# EAGLE design cubesatsim-main-1.0 (EAGLE 7.5.0)
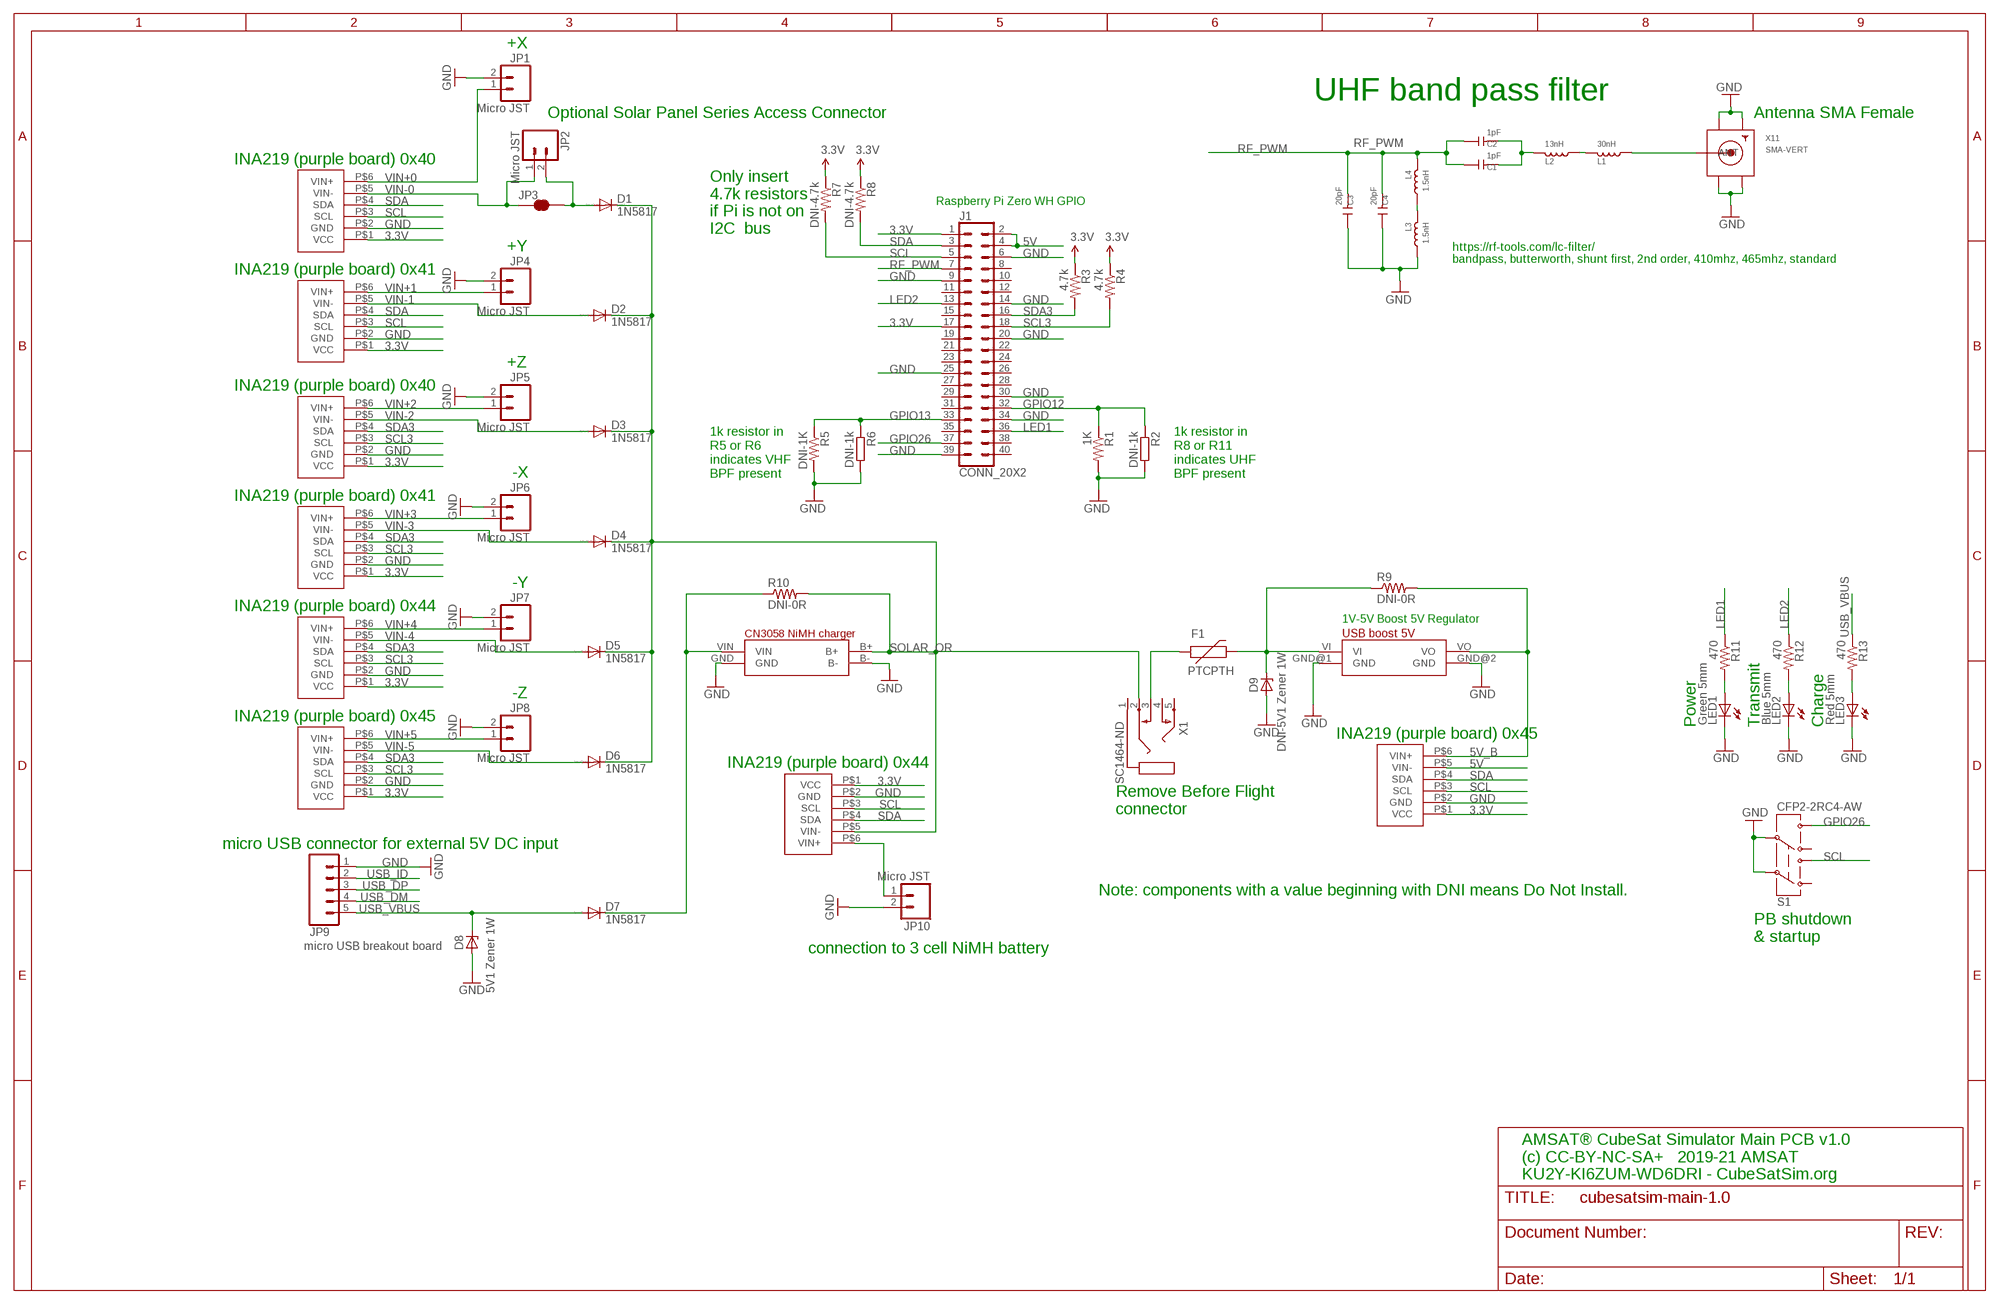
[diagram p0: schematic, sheet 1]

## Parts
C1  1pF  CERAMIC-10PF-50V-5%-NPO(0603)  [C0603]
C2  1pF  CERAMIC-10PF-50V-5%-NPO(0603)  [C0603]
C3  20pF  CERAMIC-10PF-50V-5%-NPO(0603)  [C0603]
C4  20pF  CERAMIC-10PF-50V-5%-NPO(0603)  [C0603]
D1  1N5817  DIODE-D-2.5  [D-2.5]
D2  1N5817  DIODE-D-2.5  [D-2.5]
D3  1N5817  DIODE-D-2.5  [D-2.5]
D4  1N5817  DIODE-D-2.5  [D-2.5]
D5  1N5817  DIODE-D-2.5  [D-2.5]
D6  1N5817  DIODE-D-2.5  [D-2.5]
D7  1N5817  DIODE-D-2.5  [D-2.5]
D8  5V1 Zener 1W  ZENER-DIODEZD-2.5  [ZDIO-2.5]
D9  DNI-5V1 Zener 1W  ZENER-DIODEZD-2.5  [ZDIO-2.5]
F1  PTCPTH  [PTC]
J1  CONN_20X2  [2X20]
JP1  Micro JST  M02JST-PTH-VERT  [JST-2-PTH-VERT]
JP2  Micro JST  M02JST-PTH-VERT  [JST-2-PTH-VERT]
JP3  VDD-EN  JUMPER-SMT_2_NC_TRACE_SILK  [SMT-JUMPER_2_NC_TRACE_SILK]
JP4  Micro JST  M02JST-PTH-VERT  [JST-2-PTH-VERT]
JP5  Micro JST  M02JST-PTH-VERT  [JST-2-PTH-VERT]
JP6  Micro JST  M02JST-PTH-VERT  [JST-2-PTH-VERT]
JP7  Micro JST  M02JST-PTH-VERT  [JST-2-PTH-VERT]
JP8  Micro JST  M02JST-PTH-VERT  [JST-2-PTH-VERT]
JP9  micro USB breakout board  M05NO_SILK  [1X05_NO_SILK]
JP10  Micro JST  M02JST-PTH-VERT  [JST-2-PTH-VERT]
L1  30nH  SMD-FERRITE-CHIP-120-OHM-500MA(0603)  [L0603]
L2  13nH  SMD-FERRITE-CHIP-120-OHM-500MA(0603)  [L0603]
L3  1.5nH  SMD-FERRITE-CHIP-120-OHM-500MA(0603)  [L0603]
L4  1.5nH  SMD-FERRITE-CHIP-120-OHM-500MA(0603)  [L0603]
LED1  Green 5mm  LED3MM  [LED3MM]
LED2  Blue 5mm  LED3MM  [LED3MM]
LED3  Red 5mm  LED3MM  [LED3MM]
R1  1K  RESISTORPTH-1/4W-VERT-KIT  [AXIAL-0.1EZ]
R2  DNI-1k  R-EU_R0603  [R0603]
R3  4.7k  RESISTORPTH-1/4W-VERT-KIT  [AXIAL-0.1EZ]
R4  4.7k  RESISTORPTH-1/4W-VERT-KIT  [AXIAL-0.1EZ]
R5  DNI-1K  RESISTORPTH-1/4W-VERT-KIT  [AXIAL-0.1EZ]
R6  DNI-1k  R-EU_R0603  [R0603]
R7  DNI-4.7k  RESISTORPTH-1/4W-VERT-KIT  [AXIAL-0.1EZ]
R8  DNI-4.7k  RESISTORPTH-1/4W-VERT-KIT  [AXIAL-0.1EZ]
R9  DNI-0R  RESISTORPTH-1/4W-VERT-KIT  [AXIAL-0.1EZ]
R10  DNI-0R  RESISTORPTH-1/4W-VERT-KIT  [AXIAL-0.1EZ]
R11  470  RESISTORPTH-1/4W-VERT-KIT  [AXIAL-0.1EZ]
R12  470  RESISTORPTH-1/4W-VERT-KIT  [AXIAL-0.1EZ]
R13  470  RESISTORPTH-1/4W-VERT-KIT  [AXIAL-0.1EZ]
S1  CFP2-2RC4-AW  SWITCH-DPDTOS  [OS]
U1  INA219 purple board  INA219  [INA219]
U2  INA219 purple board  INA219  [INA219]
U3  INA219 purple board  INA219  [INA219]
U4  INA219 purple board  INA219  [INA219]
U5  INA219 purple board  INA219  [INA219]
U6  CN3085-MODULE  [CN3085-MODULE]
U7  1V-5V Boost 5V Regulator  USB-BOOST  [USB-BOOST]
U8  INA219 purple board  INA219  [INA219]
U9  INA219 purple board  INA219  [INA219]
U10  INA219 purple board  INA219  [INA219]
X1  SC1464-ND  PG203J  [PG203J]
X11  SMA-VERT  [SMA-VERT]

## Nets
3.3V: J1.1 J1.17 R3.P$1 R4.P$1 R7.P$1 R8.P$1 U1.P$1(VCC) U2.P$1(VCC) U3.P$1(VCC) U4.P$1(VCC) U5.P$1(VCC) U8.P$1(VCC) U9.P$1(VCC) U10.P$1(VCC)
5V: J1.2 J1.4 U9.P$5(VIN-)
5V_B: R9.P$2 U7.VO U9.P$6(VIN+)
GND: C3.1 C4.1 D8.A D9.A J1.6 J1.9 J1.14 J1.20 J1.25 J1.30 J1.34 J1.39 JP1.2 JP4.2 JP5.2 JP6.2 JP7.2 JP8.2 JP9.1 JP10.2 L3.2 LED1.K(C) LED2.K(C) LED3.K(C) R1.P$2 R2.2 R5.P$2 R6.2 S1.2 S1.5 U1.P$2(GND) U2.P$2(GND) U3.P$2(GND) U4.P$2(GND) U5.P$2(GND) U6.B- U6.GND U7.GND@1(GND) U7.GND@2(GND) U8.P$2(GND) U9.P$2(GND) U10.P$2(GND) X11.GND1 X11.GND2 X11.GND3 X11.GND4
GPIO12: J1.32 R1.P$1 R2.1
GPIO13: J1.33 R5.P$1 R6.1
GPIO26: J1.37 S1.6
LED1: J1.36 R11.P$1
LED2: J1.13 R12.P$1
N$3: D1.A JP2.2 JP3.2
N$4: D9.C F1.P$2 R9.P$1 U7.VI
N$5: JP10.1 U10.P$6(VIN+)
N$6: LED1.A R11.P$2
N$7: F1.P$1 X1.3
N$8: L1.2 X11.ANTENNA(ANT)
N$9: LED2.A R12.P$2
N$10: C1.2 C2.2 L2.1
N$11: LED3.A R13.P$2
N$13: D7.C R10.P$1 U6.VIN
N$28: L3.1 L4.2
N$50: L1.1 L2.2
RF_PWM: C1.1 C2.1 C3.2 C4.2 J1.7 L4.1
SCL: J1.5 R7.P$2 S1.3 U1.P$3(SCL) U2.P$3(SCL) U9.P$3(SCL) U10.P$3(SCL)
SCL3: J1.18 R4.P$2 U3.P$3(SCL) U4.P$3(SCL) U5.P$3(SCL) U8.P$3(SCL)
SDA: J1.3 R8.P$2 U1.P$4(SDA) U2.P$4(SDA) U9.P$4(SDA) U10.P$4(SDA)
SDA3: J1.16 R3.P$2 U3.P$4(SDA) U4.P$4(SDA) U5.P$4(SDA) U8.P$4(SDA)
SOLAR_OR: D1.C D2.C D3.C D4.C D5.C D6.C R10.P$2 U6.B+ U10.P$5(VIN-) X1.2
USB_DM: JP9.4
USB_DP: JP9.3
USB_ID: JP9.2
USB_VBUS: D7.A D8.C JP9.5 R13.P$1
VIN+0: JP1.1 U1.P$6(VIN+)
VIN+1: JP4.1 U2.P$6(VIN+)
VIN+2: JP5.1 U3.P$6(VIN+)
VIN+3: JP6.1 U4.P$6(VIN+)
VIN+4: JP7.1 U5.P$6(VIN+)
VIN+5: JP8.1 U8.P$6(VIN+)
VIN-0: JP2.1 JP3.1 U1.P$5(VIN-)
VIN-1: D2.A U2.P$5(VIN-)
VIN-2: D3.A U3.P$5(VIN-)
VIN-3: D4.A U4.P$5(VIN-)
VIN-4: D5.A U5.P$5(VIN-)
VIN-5: D6.A U8.P$5(VIN-)
Unconnected: J1.8 J1.10 J1.11 J1.12 J1.15 J1.19 J1.21 J1.22 J1.23 J1.24 J1.26 J1.27 J1.28 J1.29 J1.31 J1.35 J1.38 J1.40 S1.1 S1.4 X1.1 X1.4 X1.5

## Notes on the sheet
- +X
- UHF band pass filter
- Optional Solar Panel Series Access Connector | Antenna SMA Female
- INA219 (purple board) 0x40
- Raspberry Pi Zero WH GPIO
- Only insert 
  4.7k resistors
  if Pi is not on
  I2C  bus
- +Y
- https://rf-tools.com/lc-filter/
  bandpass, butterworth, shunt first, 2nd order, 410mhz, 465mhz, standard
- INA219 (purple board) 0x41
- +Z
- INA219 (purple board) 0x40
- -X
- 1k resistor in 
  R5 or R6
  indicates VHF 
  BPF present
- 1k resistor in 
  R8 or R11
  indicates UHF 
  BPF present
- INA219 (purple board) 0x41
- -Y
- INA219 (purple board) 0x44
- 1V-5V Boost 5V Regulator
- -Z
- INA219 (purple board) 0x45
- Power | Transmit | Charge
- INA219 (purple board) 0x45
- INA219 (purple board) 0x44
- Remove Before Flight
  connector
- micro USB connector for external 5V DC input
- Note: components with a value beginning with DNI means Do Not Install.
- PB shutdown
  & startup
- connection to 3 cell NiMH battery
- AMSAT® CubeSat Simulator Main PCB v1.0
  (c) CC-BY-NC-SA+   2019-21 AMSAT
  KU2Y-KI6ZUM-WD6DRI - CubeSatSim.org

## Library data of the parts
C1-C4 = Seeed-OPL-Capacitor:CERAMIC-10PF-50V-5%-NPO(0603): 302010097; VALUE: 10pf
D1-D7 = diode:DIODE-: DIODE
D8 D9 = diode:ZENER-DIODE: Z-Diode
F1 = SparkFun-PowerIC:PTC: Resettable Fuse PTC Resettable Fuse. Spark Fun Electronics SKU : COM-08357
J1 = SparkFun-Connectors-AJ2:CONN_20X2: Multi connection point. Often used as Generic Header-pin footprint for 0.1 inch spaced/style header connections On any of the 0.1 inch spaced packages, you can populate with these: Break Away Headers - Straight <https://www.sparkfun.com/products/116> (PRT-00116) Break Away Male Headers - Right Angle <https://www.sparkfun.com/products/553> (PRT-00553) Female Headers <https://www.sparkfun.com/products/115> (PRT-00115) Break Away Headers - Machine Pin <https://www.sparkfun.com/products/117> (PRT-00117) Break Away Female Headers - Swiss Machine Pin <https://www.sparkfun.com/products/743> (PRT-00743)
JP1 JP2 JP4-JP8 JP10 = SparkFun-Connectors:M02: Standard 2-pin 0.1" header. Use with - straight break away headers ( PRT-00116) - right angle break away headers (PRT-00553) - swiss pins (PRT-00743) - machine pins (PRT-00117) - female headers (PRT-00115) Molex polarized connector foot print use with: PRT-08233 with associated crimp pins and housings. 2.54_SCREWTERM for use with PRT-10571. 3.5mm Screw Terminal footprints for PRT-08084 5mm Screw Terminal footprints for use with PRT-08432
JP3 = SparkFun-Jumpers:JUMPER-SMT_2_NC_TRACE: Normally closed trace jumper This jumper has a trace between two pads so it's normally closed (NC). Use a razor knife to open the connection. For best results follow the IPC guidelines for cutting traces: Cutout at least 0.063 mm (0.005 in). Remove all loose material to clean up the cut area. Seal the cut with an approved epoxy. Reapply solder to reclose the connection.
JP9 = SparkFun-Connectors:M05: Header 5 Standard 5-pin 0.1" header. Use with straight break away headers (SKU : PRT-00116), right angle break away headers (PRT-00553), swiss pins (PRT-00743), machine pins (PRT-00117), and female headers (PRT-00115). Molex polarized connector foot print use with SKU : PRT-08230 with associated crimp pins and housings.
L1-L4 = Seeed-OPL-Inductor:SMD-FERRITE-CHIP-120-OHM-500MA(0603): 303030001; MPN: BLM18AG121SN1D; VALUE: 120
LED1-LED3 = adafruit:LED: LED OSRAM: - CHIPLED LG R971, LG N971, LY N971, LG Q971, LY Q971, LO R971, LY R971 LH N974, LH R974 LS Q976, LO Q976, LY Q976 LO Q996 - Hyper CHIPLED LW Q18S LB Q993, LB Q99A, LB R99A - SideLED LS A670, LO A670, LY A670, LG A670, LP A670 LB A673, LV A673, LT A673, LW A673 LH A674 LY A675 LS A676, LA A676, LO A676, LY A676, LW A676 LS A679, LY A679, LG A679 - Hyper Micro SIDELED® LS Y876, LA Y876, LO Y876, LY Y876 LT Y87S - SmartLED LW L88C, LW L88S LB L89C, LB L89S, LG L890 LS L89K, LO L89K, LY L89K LS L896, LA L896, LO L896, LY L896 - TOPLED LS T670, LO T670, LY T670, LG T670, LP T670 LSG T670, LSP T670, LSY T670, LOP T670, LYG T670 LG T671, LOG T671, LSG T671 LB T673, LV T673, LT T673, LW T673 LH T674 LS T676, LA T676, LO T676, LY T676, LB T676, LH T676, LSB T676, LW T676 LB T67C, LV T67C, LT T67C, LS T67K, LO T67K, LY T67K, LW E67C LS E67B, LA E67B, LO E67B, LY E67B, LB E67C, LV E67C, LT E67C LW T67C LS T679, LY T679, LG T679 LS T770, LO T770, LY T770, LG T770, LP T770 LB T773, LV T773, LT T773, LW T773 LH T774 LS E675, LA E675, LY E675, LS T675 LS T776, LA T776, LO T776, LY T776, LB T776 LHGB T686 LT T68C, LB T68C - Hyper Mini TOPLED® LB M676 - Mini TOPLED Santana® LG M470 LS M47K, LO M47K, LY M47K Source: http://www.osram.convergy.de/
R1 R3-R5 R7-R13 = SparkFun-Resistors:RESISTOR: Resistor Basic schematic elements and footprints for 0603, 1206, and PTH resistors.
R2 R6 = resistor:R-EU_: RESISTOR, European symbol
S1 = SparkFun-Retired-AJ:SWITCH-DPDT: DPDT Version of the COM-00597
U1-U5 U8-U10 = cubsat-sim:INA219
U6 = cubsat-sim:CN3085-MODULE
U7 = cubsat-sim:USB-BOOST
X1 = con-hirschmann:PG203J: MIC/HEADPHONE JACK KS-S stereo microphone/headphone jack PG203JN (Schukat)
X11 = zum_radio:SMA-VERT

## Net classes
1 RF: clearance 0.381 mm

## Board
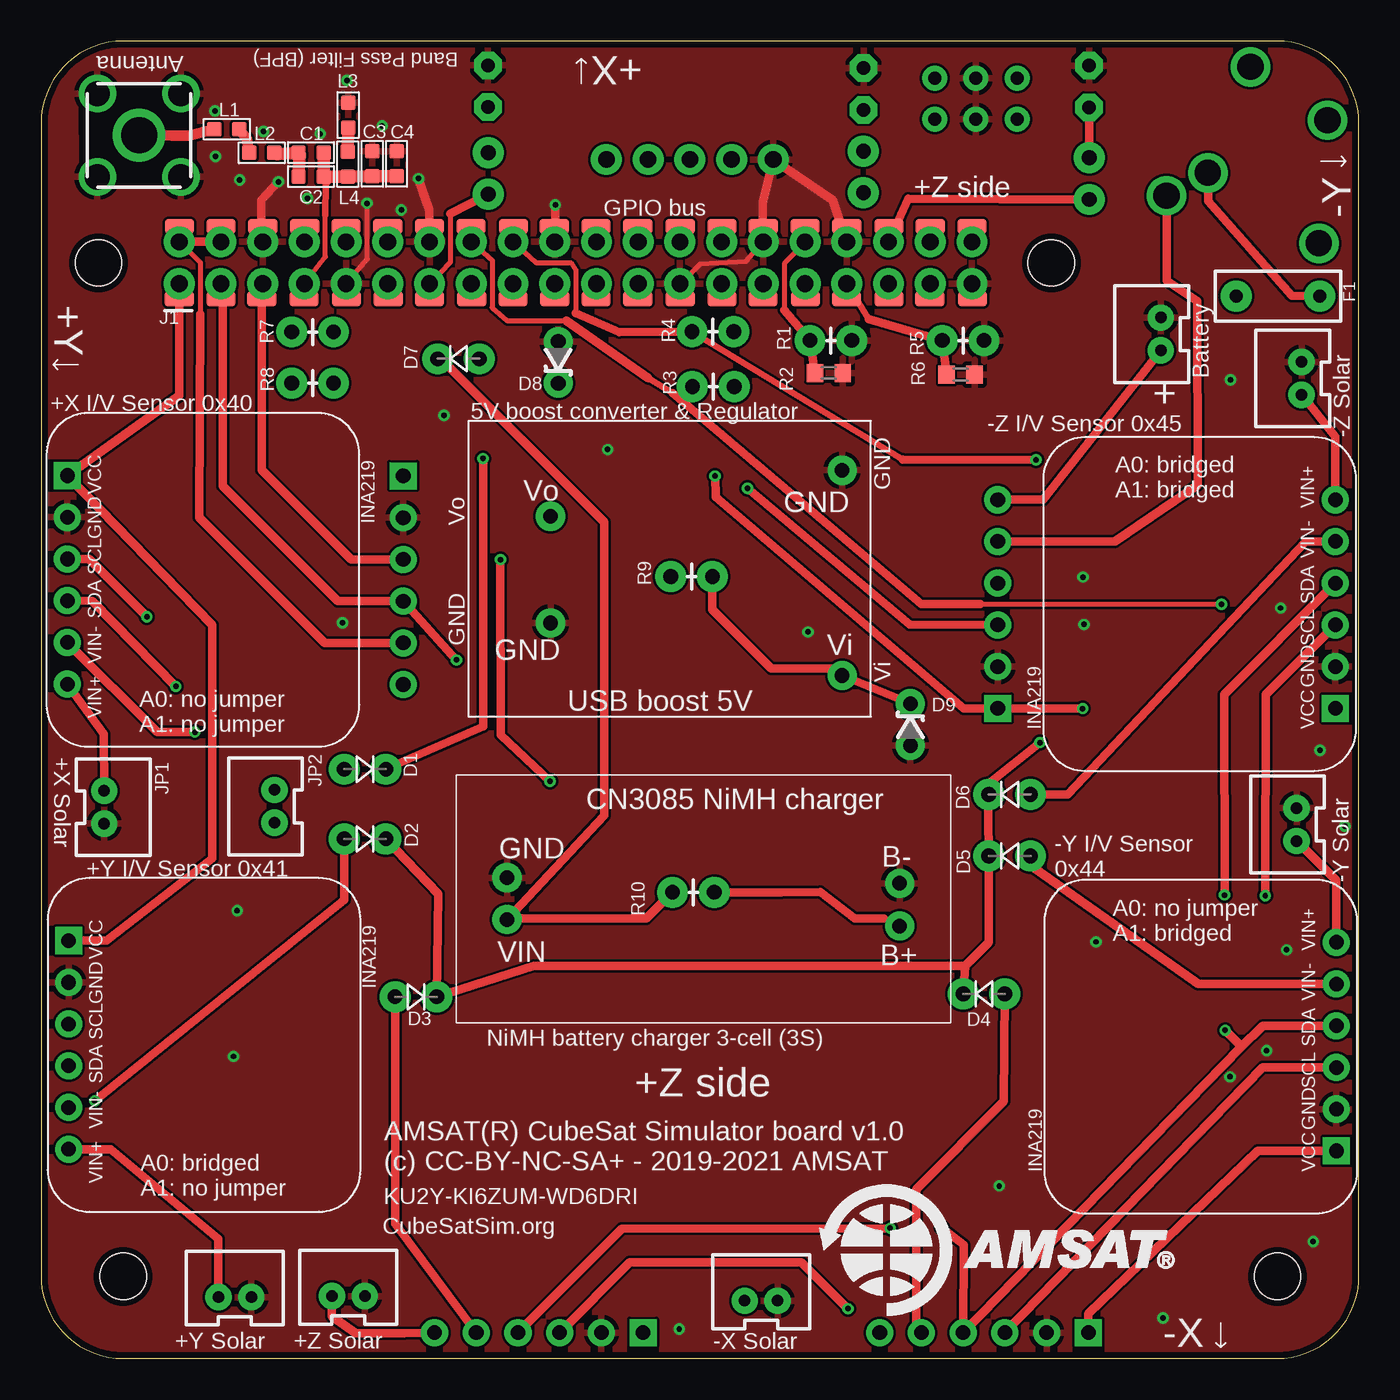
[diagram p1: board, top side]
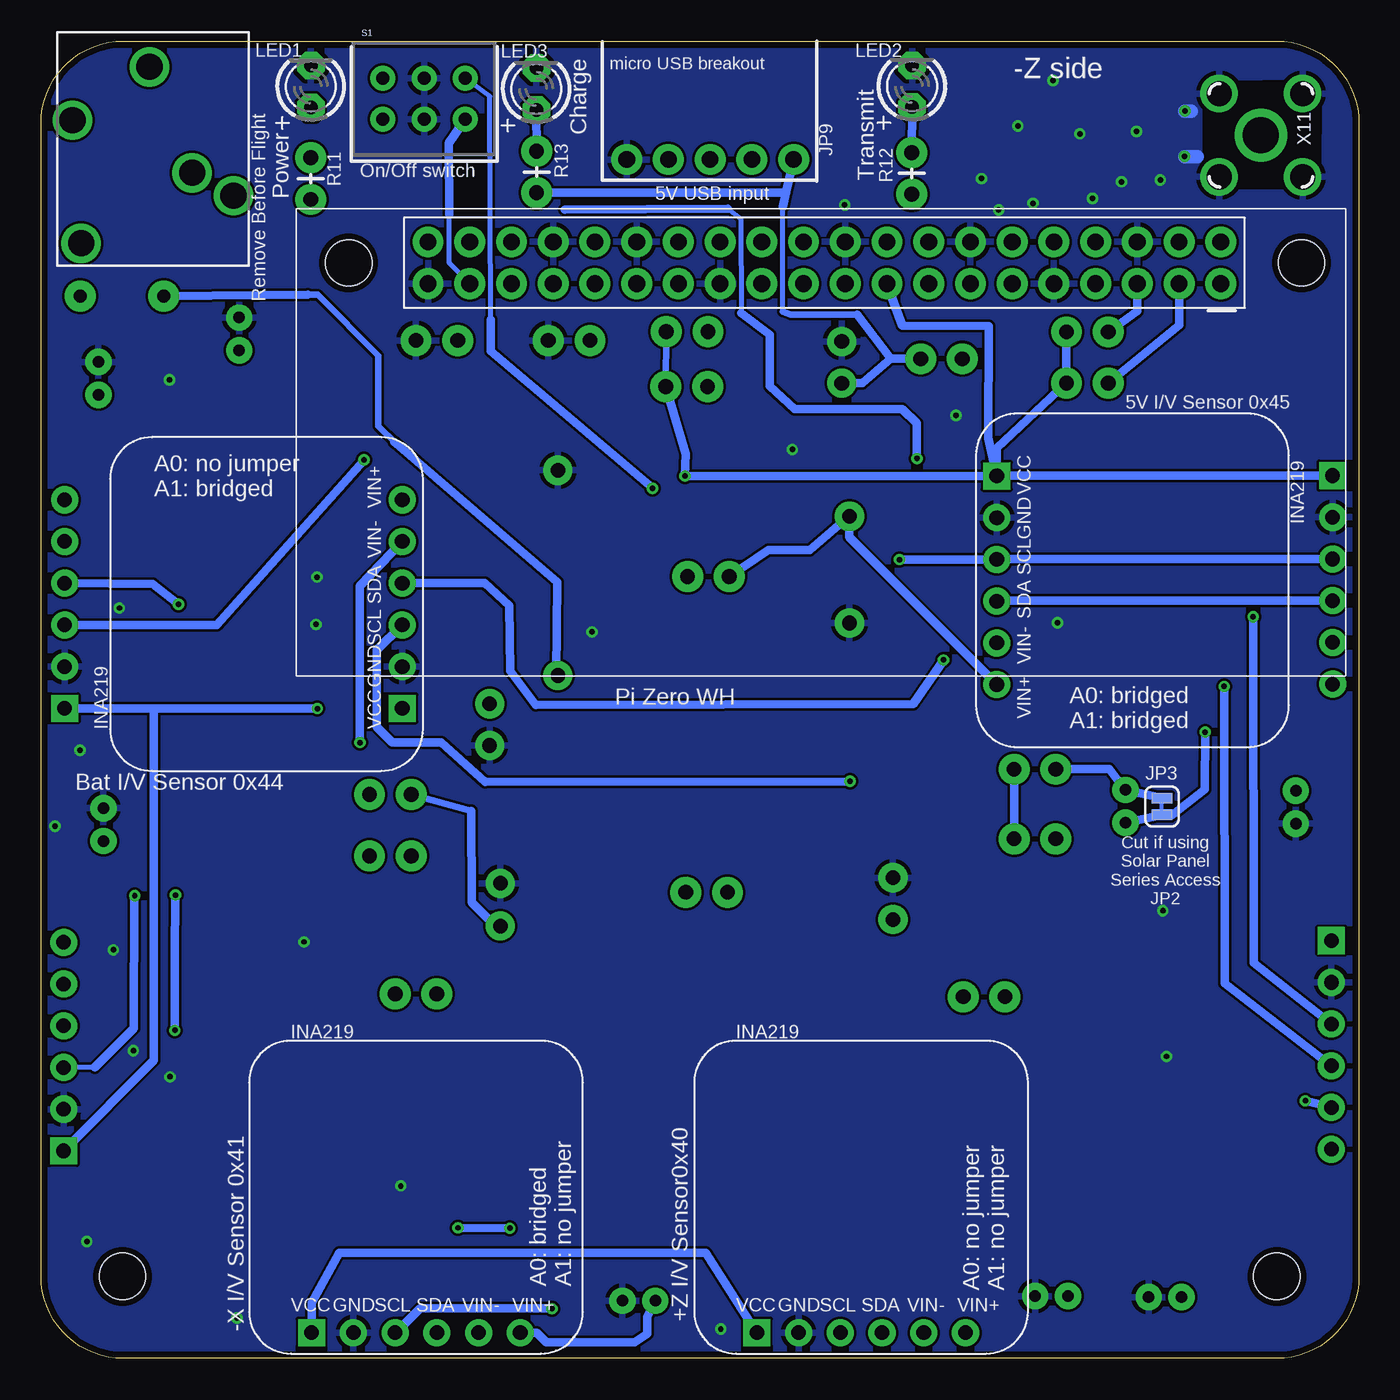
[diagram p2: board, bottom side, seen from below]

Size 80.23 x 80.23 mm. Coordinates in mm from the lower left corner, seen from the top.
Outline: 0,75.23 0,5 arc90 5,0 75.23,0 arc90 80.23,5 80.23,75.23 arc90 75.23,80.23 5,80.23 arc90 0,75.23
Copper layers (1*16): Top 0.0356mm / dielectric 1.5011mm / Bottom 0.0356mm
Design rules "LaenPCBOrder *": minimum track width 6mil, minimum drill 13mil, track to track 6mil, track to pad 6mil, pad to pad 6mil, via to via 6mil, smd to smd 6mil, copper to edge 15mil, drill to drill 6mil, minimum pad ring 7mil, minimum via ring 7mil, stop-mask expansion 3mil, vias tented up to drill 25mil, thermal gap 10mil
Holes 2.8 mm at 3.5,66.73 61.5,66.73 75.28,5 5,5

### Footprints (pad centres in the part's own frame; a part is rotated, then mirrored left to right if it is on the bottom)
C0603 = smd 0.889 x 0.889: 1 0,0.762; 2 0,-0.762
D-2.5 = drill 0.899 pad 1.88: A 1.27,0; C -1.27,0
ZDIO-2.5 = drill 0.889 pad 1.778: A 1.27,0; C -1.27,0
PTC = drill 0.8 pad 1.88: P$1 -2.54,0; P$2 2.54,0
2X20 = drill 1.016 pad 1.88: 1 -24.13,-1.27; 2 -24.13,1.27; 3 -21.59,-1.27; 4 -21.59,1.27; 5 -19.05,-1.27; 6 -19.05,1.27; 7 -16.51,-1.27; 8 -16.51,1.27; 9 -13.97,-1.27; 10 -13.97,1.27; 11 -11.43,-1.27; 12 -11.43,1.27; 13 -8.89,-1.27; 14 -8.89,1.27; 15 -6.35,-1.27; 16 -6.35,1.27; 17 -3.81,-1.27; 18 -3.81,1.27; 19 -1.27,-1.27; 20 -1.27,1.27; 21 1.27,-1.27; 22 1.27,1.27; 23 3.81,-1.27; 24 3.81,1.27; 25 6.35,-1.27; 26 6.35,1.27; 27 8.89,-1.27; 28 8.89,1.27; 29 11.43,-1.27; 30 11.43,1.27; 31 13.97,-1.27; 32 13.97,1.27; 33 16.51,-1.27; 34 16.51,1.27; 35 19.05,-1.27; 36 19.05,1.27; 37 21.59,-1.27; 38 21.59,1.27; 39 24.13,-1.27; 40 24.13,1.27 | smd 1.778 x 0.914: P$1 -19.05,2.21; P$4 -16.485,2.21; P$10 -21.59,2.21; P$11 -24.117,2.223; P$12 -13.97,2.21; P$13 -11.43,2.21; P$14 -8.89,2.21; P$16 -6.375,2.21; P$17 -3.785,2.21; P$20 -1.295,2.21; P$21 1.245,2.21; P$22 3.785,2.21; P$23 6.375,2.21; P$27 8.915,2.21; P$28 11.43,2.21; P$29 13.97,2.21; P$30 16.51,2.21; P$31 19.075,2.21; P$32 21.59,2.21; P$33 24.13,2.21; P$41 -19.101,-2.21; P$44 -16.535,-2.21; P$50 -21.59,-2.21; P$51 -24.13,-2.21; P$52 -13.945,-2.21; P$53 -11.405,-2.21; P$54 -8.89,-2.21; P$56 -6.325,-2.21; P$57 -3.81,-2.21; P$60 -1.27,-2.21; P$61 1.245,-2.21; P$62 3.785,-2.21; P$63 6.375,-2.21; P$67 8.915,-2.21; P$68 11.405,-2.21; P$69 13.995,-2.21; P$70 16.485,-2.21; P$71 19.075,-2.21; P$72 21.565,-2.21; P$73 24.155,-2.21
JST-2-PTH-VERT = drill 0.7 pad 1.6: 1 -1,-0.55; 2 1,-0.55
SMT-JUMPER_2_NC_TRACE_SILK = smd 0.635 x 1.27: 1 -0.508,0; 2 0.508,0
1X05_NO_SILK = drill 1.016 pad 1.88: 1 0,0; 2 2.54,0; 3 5.08,0; 4 7.62,0; 5 10.16,0
L0603 = smd 0.889 x 0.889: 1 -0.762,0; 2 0.762,0
LED3MM = drill 0.813 pad 1.676 octagon: A -1.27,0; K 1.27,0
AXIAL-0.1EZ = drill 0.9 pad 1.88: P$1 0,0; P$2 2.54,0
R0603 = smd 1 x 1.1: 1 -0.85,0; 2 0.85,0
OS = drill 0.787 pad 1.524: 1 -2.515,1.245; 2 0,1.245; 3 2.515,1.245; 4 -2.515,-1.245; 5 0,-1.245; 6 2.515,-1.245
INA219 = drill 0.889 pad 1.651 square: P$1 3.81,2.54 | drill 0.889 pad 1.651: P$2 6.35,2.54; P$3 8.89,2.54; P$4 11.43,2.54; P$5 13.97,2.54; P$6 16.51,2.54
CN3085-MODULE = drill 0.889 pad 1.778: B+ 27,5.9; B- 27,8.5; GND 3.1,8.84; VIN 3.1,6.3
USB-BOOST = drill 0.889 pad 1.778: GND@1 1.75,3; GND@2 19.5,12.3; VI 1.75,15.5; VO 19.5,5.8
PG203J = drill 1.6: 1 -5.004,-0.203; 2 2.845,4.902; 3 1.448,2.388; 4 5.74,-4.369; 5 -1.753,-4.902
SMA-VERT = drill 2.2: ANTENNA 0,0 | drill 1.524: GND1 -2.54,2.54; GND2 2.54,2.54; GND3 -2.54,-2.54; GND4 2.54,-2.54

### Placement (x,y rotation side)
C1  16.43,73.44 270 top
C2  16.43,71.98 270 top
C3  20.17,72.75 0 top
C4  21.64,72.75 0 top
D1  19.72,35.88 180 top
D2  19.72,31.65 180 top
D3  22.82,22.03 180 top
D4  57.4,22.21 0 top
D5  58.97,30.6 0 top
D6  58.97,34.34 0 top
D7  25.41,60.88 0 top
D8  31.48,60.66 90 top
D9  52.92,38.6 270 top
F1  75.3,64.7 180 top
J1  32.54,66.73 0 top
JP1  4.39,33.57 270 top
JP2  13.67,33.62 90 top
JP3  11.99,33.61 90 bottom
JP4  11.8,4.29 0 top
JP5  18.71,4.34 0 top
JP6  43.83,4.06 0 top
JP7  75.88,32.51 90 top
JP8  76.19,59.69 90 top
JP9  44.58,73.02 0 bottom
JP10  67.61,62.39 90 top
L1  11.32,74.86 180 top
L2  13.44,73.42 180 top
L3  18.69,75.72 90 top
L4  18.67,72.73 90 top
LED1  63.8,77.46 90 bottom
LED2  27.2,77.48 90 bottom
LED3  50.08,77.31 90 bottom
R1  46.81,61.99 0 top
R2  47.96,60.01 0 top
R3  42.19,59.18 180 top
R4  42.17,62.52 180 top
R5  54.86,61.99 0 top
R6  55.98,59.91 0 top
R7  17.81,62.52 180 top
R8  17.81,59.4 180 top
R9  40.87,47.62 180 top
R10  38.44,28.39 0 top
R11  63.82,70.58 90 bottom
R12  27.23,70.9 90 bottom
R13  50.06,70.99 90 bottom
S1  56.91,76.71 0 bottom
U1  -0.94,57.57 270 top
U2  -0.86,29.25 270 top
U3  40.46,-0.97 0 bottom
U4  67.56,-0.97 0 bottom
U5  81.39,8.83 90 top
U6  25.27,20.43 0 top
U7  50.52,57.09 180 top
U8  81.33,35.78 90 top
U9  24.59,57.55 270 bottom
U10  55.7,35.78 90 bottom
X1  73.42,73.66 270 bottom
X11  5.97,74.49 180 bottom

### Tracks (layer width: path | path; a pad name or v marks a point on that pad's centre or on a via)
3.3V  (via drill 0.33)
  Top 0.508: U2.P$1 3.99,25.44 10.43,30.45 10.41,44.66 U1.P$1 8.42,58.65 J1.1 | U4.P$1 63.74,2.71 74.07,12.64 U5.P$1 | v63.41,39.58 U10.P$1 56.19,39.59 41.06,52.44 v41.03,53.74
  Bottom 0.406: R4.P$1 R3.P$1
  Bottom 0.508: 73.36,39.59 U8.P$1 | U1.P$1 22.05,53.77 U9.P$1 | U3.P$1 39.75,6.45 62.08,6.45 63.74,3.4 U4.P$1 | U5.P$1 73.36,18.14 73.36,39.59 | v63.41,39.58 73.36,39.59 | U9.P$1 v41.03,53.74 41,55.06 R3.P$1 | R7.P$1 R8.P$1 22.05,55.43 U9.P$1 | U9.P$1 22.55,56.04 22.54,62.87 27.79,62.88 J1.17
5V
  Top 0.305: J1.2 9.68,66.77 9.68,63.61
  Top 0.508: 9.68,63.61 9.64,51.2 17.26,43.58 U9.P$5 | J1.2 J1.4
5V_B
  Bottom 0.508: U9.P$6 31.02,50.01 U7.VO 33.44,49.24 35.97,49.22 R9.P$2
GND  (via drill 0.33)
  Top 0.305: J1.9 19.86,66.95 v19.85,70.35 | J1.25 40.13,66.67 42.93,66.82 J1.30
  Top 0.406: J1.6 13.41,68
  Top 0.508: 13.41,68 13.41,70.53 v14.45,71.66 | J1.14 23.62,69.92 v22.97,71.85 | J1.20 v31.3,70.25 | J1.30 43.94,70.38 JP9.1 48.21,70.53 J1.34
  Bottom 0.813: 9.84,73.2 v10.62,73.2 | 10.2,75.96 v10.59,75.96
  other vias: 18.62,77.83 16.22,70.64 74.61,18.74 16.99,74.58 11.71,18.4 77.44,7.12 12.09,71.77 72.42,59.59 13.54,74.72 68.3,2.46 20.76,75.06 21.93,69.94 38.85,1.78 75.46,45.7 63.44,47.58 75.83,24.89 79.37,32.42 77.85,37.04 72.38,17.15 63.49,44.7 46.68,44.24 18.35,44.8 34.49,55.35 64.22,25.37 58.33,10.51 11.94,27.26 24.54,57.44
  pour Bottom: 0,75.23 0,5 arc90 5,0 75.23,0 arc90 80.23,5 80.23,75.23 arc90 75.23,80.23 5,80.23 arc90
  pour Top: 0,75.23 0,5 arc90 5,0 75.23,0 arc90 80.23,5 80.28,75.23 arc90 75.23,80.23 5,80.23 arc90
GPIO12
  Top 0.305: J1.32 45.25,66.69 45.24,63.85
  Top 0.508: 45.24,63.85 R1.P$1 R2.1
GPIO13
  Top 0.406: J1.33 50.39,63.29
  Top 0.508: 50.39,63.29 R5.P$1 R6.1
GPIO26
  Bottom 0.305: J1.37 55.38,66.74 55.38,69.67
  Bottom 0.508: S1.6 55.4,74.01 55.38,69.67
LED1
  Top 0.508: J1.36 52.78,70.62 R11.P$1
LED2
  Top 0.305: 24.92,69.7 24.92,66.77 J1.13
  Top 0.508: R12.P$1 24.92,69.7
N$1
  cutout Top: 2.55,77.53 2.58,71.47 9.27,71.44 9.19,77.49
N$2
  cutout Bottom: 2.5,77.62 2.55,71.46 9.31,71.41 9.23,77.56
N$3
  Bottom 0.508: D1.A 15.19,35.88 JP2.2 JP3.2
N$4
  Top 0.406: 48.33,42.03 U7.VI
  Top 0.508: R9.P$1 40.87,45.61 44.45,42.03 48.33,42.03 | U7.VI D9.C
  Bottom 0.406: 63.98,64.79 63.4,64.79 59.69,61.08 59.69,56.77 58.65,55.73
  Bottom 0.508: U7.VI 48.86,41.68 48.82,47.27 58.65,55.73 58.73,55.8 | 63.98,64.79 F1.P$2
N$5
  Top 0.508: JP10.1 61.01,52.29 U10.P$6
N$6
  Top 0.508: LED1.A R11.P$2
N$7
  Top 0.508: X1.3 71.04,70.47 76.15,64.71 F1.P$1
N$8
  Top 0.635: L1.2 9,74.47 7.99,74.47 X11.ANTENNA
N$9
  Bottom 0.508: LED2.A R12.P$2
N$10
  Top 0.508: L2.1 14.36,73.34 | C1.2 15.73,73.32
  Top 0.762: 14.36,73.34 C1.2 | 15.73,73.32 C2.2
N$11
  Bottom 0.508: LED3.A R13.P$2
N$13
  Top 0.406: R10.P$1 | 28.02,26.79 U6.VIN | D7.C 24.33,60.88
  Top 0.508: R10.P$1 36.83,26.79 28.02,26.79 | 24.33,60.88 34.29,50.92 34.29,33.06 U6.VIN
N$28
  Top 0.762: L3.1 L4.2
N$50
  Top 0.635: L1.1 12.51,74.28 L2.2
RF_PWM
  Top 0.305: J1.7 17.3,67.09 17.31,69.61
  Top 0.406: 17.31,69.61 17.34,71.52 17.79,71.97
  Top 0.508: 17.79,71.97 C2.1
  Top 0.762: C4.2 C3.2 L4.1 17.79,71.97 | C2.1 C1.1
SCL  (via drill 0.33)
  Top 0.305: J1.5 13.45,65.42
  Top 0.508: v6.44,45.17 2.92,48.68 U1.P$3 | 13.45,65.42 13.45,54.11 18.9,48.66 U9.P$3 | v27.96,48.65 27.98,37.95 v30.99,35.15 | U10.P$3 52.9,44.68 v43,52.99
  Bottom 0.305: 52.86,63.25 52.91,76.85 S1.3
  Bottom 0.508: U1.P$3 22.05,48.68 U9.P$3 v27.96,48.65 | U2.P$3 6.41,24.09 v6.44,45.17 | U10.P$3 59.78,43.13 59.78,38.45 58.84,37.51 55.87,37.51 53.2,35.12 v30.99,35.15 | R7.P$2 13.5,63.77 J1.5 | v43,52.99 52.84,61.35 52.86,63.25
SCL3  (via drill 0.33)
  Top 0.305: J1.18 30.15,66.72 32.27,66.72 32.56,66.29 32.56,63.64
  Top 0.406: 52.46,54.73 R4.P$2
  Top 0.508: U4.P$3 74.36,17.72 U5.P$3 | U8.P$3 74.55,40.43 v74.52,28.17 | U3.P$3 35.85,5.85 46.29,5.85 v49.11,3.03 v49.12,3.03 | 32.56,63.64 35.2,62.52 R4.P$2 | 52.46,54.73 v60.57,54.72
  Bottom 0.305: v74.52,28.17 74.56,28.14 | 76.96,17.72 U5.P$3
  Bottom 0.508: 74.56,28.14 74.59,20.1 76.96,17.72 | v49.12,3.03 49.15,3.05 57.14,3.05 58.2,1.99 U4.P$3 | v60.57,54.72 69.53,44.67 U8.P$3
SDA  (via drill 0.33)
  Top 0.305: J1.3 11.05,65.36
  Top 0.508: v8.2,40.92 3.11,46.12 U1.P$4 | 11.05,65.36 11.05,53.12 18.05,46.12 U9.P$4 v25.29,42.54
  Bottom 0.508: U1.P$4 22.05,46.14 U9.P$4 | U2.P$4 8.18,22.85 v8.2,40.92 | U10.P$4 53.23,47.22 51.71,45.84 51.65,41.85 50.13,39.79 27.13,39.85 v25.29,42.54 | R8.P$2 10.95,62.93 J1.3
SDA3  (via drill 0.33)
  Top 0.305: 73.01,19.06 73.01,18.91 | 57.19,45.93 v71.87,45.93 | J1.16 27.47,66.88 27.46,64 28.38,63.2 31.98,63.21
  Top 0.406: 36.97,59.71 38.44,58.79 | R3.P$2 39.03,58.29
  Top 0.508: U5.P$4 74.36,20.26 73.01,18.91 U4.P$4 56.16,6.93 v54.84,7.96 | U8.P$4 72.03,40.43 v72.05,28.23 | v72.08,19.98 73.01,19.06 | U3.P$4 35.36,7.89 v51.69,7.93 | 38.44,58.79 39.03,58.29 53.58,45.93 57.19,45.93 | 31.98,63.21 36.97,59.71
  Bottom 0.508: v72.05,28.23 72.08,24.44 v72.08,19.98 | v51.69,7.93 v54.84,7.96 | v71.87,45.93 73.43,47.17 U8.P$4
SOLAR_OR  (via drill 0.33)
  Top 0.406: 51.3,26.79 U6.B+
  Top 0.508: U10.P$5 58.26,49.74 65.37,49.74 70.42,53.19 70.38,64.38 68.52,65.63 X1.2 | D2.C 24.17,28.3 D3.C 30,23.89 55.36,23.91 56.26,23.9 | D1.C 26.91,38.5 v26.91,54.81 | R10.P$2 45.07,28.39 47.45,28.42 49.53,26.79 51.3,26.79 | v60.82,37.51 57.7,35.01 D6.C 57.67,33.09 D5.C 57.68,30.58 57.68,25.33 56.26,23.9 | 56.26,23.9 D4.C
  Bottom 0.305: 38.42,70.02 37.64,69.41 37.62,63.64
  Bottom 0.406: 54.03,33.33 D6.C
  Bottom 0.508: 48.36,69.95 38.42,70.02 | 37.62,63.64 35.87,62.35 35.87,59.2 34.34,57.83 27.79,57.83 26.91,56.95 v26.91,54.81 | U10.P$5 60.83,47.03 60.82,38.32 v60.82,37.51 | 54.03,33.33 54.01,27.77 52.53,26.28 U6.B+ | D1.C D2.C
USB_VBUS
  Bottom 0.305: 35.09,63.75 35.08,70.12
  Bottom 0.406: 34.86,70.99 34.86,71.08 | 35.09,63.75 34.59,63.57 30.53,63.57
  Bottom 0.508: 35.08,70.12 34.86,71.08 JP9.5 | R13.P$1 34.86,70.99 | 28.5,60.89 D7.A | D8.C 30.23,59.4 28.5,60.89 | 30.53,63.57 28.5,60.89
VIN+0
  Top 0.508: U1.P$6 3.81,38.02 JP1.1
VIN+1
  Top 0.508: U2.P$6 4.25,12.74 10.79,7.28 JP4.1
VIN+2
  Top 0.508: U3.P$6 22.12,1.54 19.15,1.54 17.7,2.56 JP5.1
VIN+3
  Bottom 0.508: JP6.1 43.32,2.55 43.32,1.49 44.09,1 49.47,0.97 50.06,1.57 U4.P$6
VIN+4
  Top 0.508: JP7.1 78.85,29.12 U5.P$6
VIN+5
  Top 0.508: JP8.1 78.79,56.13 U8.P$6
VIN-0  (via drill 0.33)
  Top 0.508: U1.P$5 7.06,38.14 v9.36,38.14
  Bottom 0.406: JP3.1 11.38,33.09
  Bottom 0.508: v9.36,38.14 9.4,34.66 11.38,33.09 | JP3.1 JP2.1
VIN-1  (via drill 0.33)
  Top 0.508: v3.26,15.69 18.47,27.93 D2.A
  Bottom 0.508: U2.P$5 1.7,15.31 v3.26,15.69
VIN-2
  Top 0.508: U3.P$5 21.55,8.2 D3.A
VIN-3
  Top 0.508: U4.P$5 53.28,2.2 53.29,10.29 58.6,15.66 D4.A
VIN-4
  Top 0.508: U5.P$5 78.84,22.82 70.43,22.82 60.28,30 D5.A
VIN-5
  Top 0.508: U8.P$5 77,49.75 62.5,34.36 D6.A

### Text on the board
tPlace: Band Pass Filter (BPF) | Antenna | +X | +Z side | GPIO bus | -Y | +Y | Battery | +X I/V Sensor 0x40 | 5V boost converter & Regulator | -Z I/V Sensor 0x45 | -Z Solar | GND | A0: bridged / A1: bridged | Vo | GND | Vi | A0: no jumper / A1: no jumper | +X Solar | +Y I/V Sensor 0x41 | -Y I/V Sensor / 0x44 | -Y Solar | A0: no jumper / A1: bridged | NiMH battery charger 3-cell (3S) | +Z side | AMSAT(R) CubeSat Simulator board v1.0 / (c) CC-BY-NC-SA+ - 2019-2021 AMSAT | A0: bridged / A1: no jumper | KU2Y-KI6ZUM-WD6DRI | CubeSatSim.org | -X | +Y Solar | +Z Solar | -X Solar
bPlace: -Z side | micro USB breakout | Charge | Transmit | On/Off switch | Power | 5V USB input | Remove Before Flight | 5V I/V Sensor 0x45 | A0: no jumper / A1: bridged | Pi Zero WH | A0: bridged / A1: bridged | Bat I/V Sensor 0x44 | A0: no jumper / A1: no jumper | A0: bridged / A1: no jumper | +Z I/V Sensor0x40 | -X I/V Sensor 0x41
tNames: +
bNames: Cut if using / Solar Panel / Series Access / JP2